# EAGLE design I2C_Sniff (EAGLE 5.11)
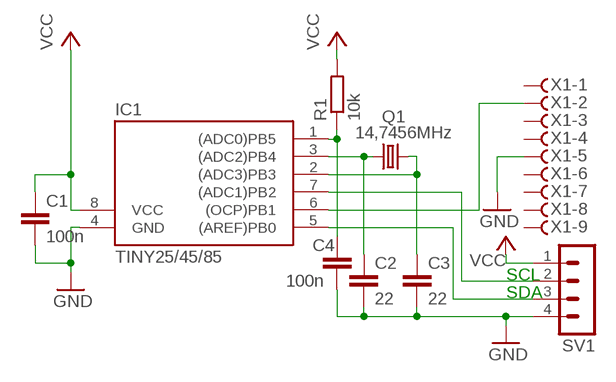
[diagram p0: schematic, sheet 1]

## Parts
C1  100n  C-EUC0805  [C0805]
C2  22  C-EUC0805  [C0805]
C3  22  C-EUC0805  [C0805]
C4  100n  C-EUC0805  [C0805]
IC1  TINY25/45/85  [DIL08]
Q1  14,7456MHz  CRYSTALHC49S  [HC49/S]
R1  10k  R-EU_M0805  [M0805]
SV1  MA04-1  [MA04-1]
X1  F09DS  [F09D]

## Nets
GND: C1.2 C2.2 C3.2 C4.2 IC1.4(GND) SV1.4 X1.5
N$1: C2.1 IC1.3((ADC2)PB4) Q1.1
N$2: C3.1 IC1.2((ADC3)PB3) Q1.2
N$5: C4.1 IC1.1((ADC0)PB5) R1.1
N$7: IC1.6((OCP)PB1) X1.2
N$8: IC1.7((ADC1)PB2) SV1.2
N$9: IC1.5((AREF)PB0) SV1.3
VCC: C1.1 IC1.8(VCC) R1.2 SV1.1
Unconnected: X1.1 X1.3 X1.4 X1.6 X1.7 X1.8 X1.9

## Notes on the sheet
- SCL
- SDA

## Library data of the parts
C1-C4 = rcl:C-EU: CAPACITOR, European symbol
IC1 = avr-6:TINY25/45/85
Q1 = crystal:CRYSTAL: CRYSTAL
R1 = rcl:R-EU_: RESISTOR, European symbol
SV1 = con-lstb-E:MA04-1: PIN HEADER
X1 = con-subd:F09?S: SUB-D

## Board
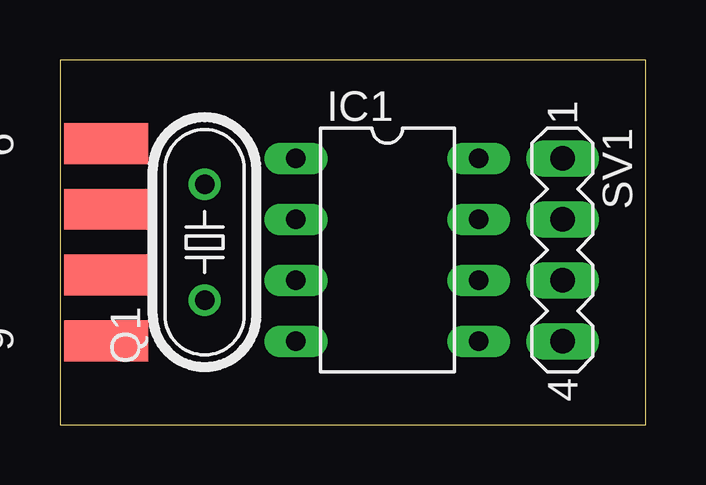
[diagram p1: board, top side]
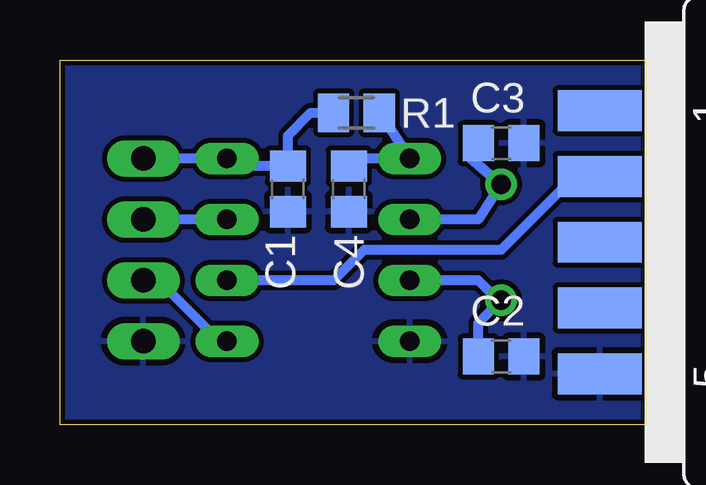
[diagram p2: board, bottom side, seen from below]

Size 24.43 x 15.22 mm. Coordinates in mm from the lower left corner, seen from the top.
Outline: 0,0 24.43,0 24.43,15.22 0,15.22 0,0
Copper layers (1*16): Top 0.035mm / dielectric 1.5mm / Bottom 0.035mm
Design rules "default *": minimum track width 10mil, minimum drill 24mil, track to track 8mil, track to pad 8mil, pad to pad 8mil, via to via 8mil, smd to smd 8mil, copper to edge 8mil, drill to drill 8mil, minimum pad ring 10mil, minimum via ring 8mil, stop-mask expansion 4mil, vias tented up to drill 0mil, thermal gap 10mil

### Footprints (pad centres in the part's own frame; a part is rotated, then mirrored left to right if it is on the bottom)
C0805 = smd 1.3 x 1.5: 1 -0.95,0; 2 0.95,0
DIL08 = drill 0.813 long: 1 -3.81,-3.81; 2 -1.27,-3.81; 3 1.27,-3.81; 4 3.81,-3.81; 5 3.81,3.81; 6 1.27,3.81; 7 -1.27,3.81; 8 -3.81,3.81
HC49/S = drill 0.813 round: 1 -2.413,0; 2 2.413,0
M0805 = smd 1.3 x 1.6: 1 -0.95,0; 2 0.95,0
MA04-1 = drill 1.016 long: 1 -3.81,0; 2 -1.27,0; 3 1.27,0; 4 3.81,0
F09D = smd 1.7 x 3.5: 1 -5.486,-6.045; 2 -2.743,-6.045; 3 0,-6.045; 4 2.743,-6.045; 5 5.486,-6.045 | smd 1.7 x 3.5 bottom: 6 -4.115,-6.045; 7 -1.372,-6.045; 8 1.372,-6.045; 9 4.115,-6.045

### Placement (x,y rotation side)
C1  14.92,9.84 270 bottom
C2  6.03,2.86 0 bottom
C3  6.03,11.75 0 bottom
C4  12.38,9.84 270 bottom
IC1  13.65,7.3 270 top
Q1  6.03,7.62 90 top
R1  12.06,13.02 180 bottom
SV1  20.95,7.3 270 top
X1  -4.13,7.62 270 bottom

### Tracks (layer width: path | path; a pad name or v marks a point on that pad's centre or on a via)
GND
  pour Bottom: -0.32,15.56 24.45,15.56 24.45,-0.32 -0.32,-0.32
N$1
  Bottom 0.406: C2.1 6.98,4.25 Q1.1 6.03,5.08 6.99,6.03 IC1.3
N$2
  Bottom 0.406: C3.1 7.3,11.11 Q1.2 6.99,8.57 IC1.2
N$5
  Bottom 0.406: R1.1 IC1.1 12.06,11.11 C4.1
N$7
  Bottom 0.406: IC1.6 13.02,6.03 11.75,7.3 6.03,7.3 2.86,10.48 2.03,10.48 X1.2
N$8
  Bottom 0.406: IC1.7 SV1.2
N$9
  Bottom 0.406: IC1.5 17.78,3.49 20.32,6.03 SV1.3
VCC
  Bottom 0.406: R1.2 13.97,13.02 14.92,12.06 C1.1 17.14,10.79 IC1.8 SV1.1